# Altium schematic sheet kuzgunfe_fc0.2.SchDoc
size A3
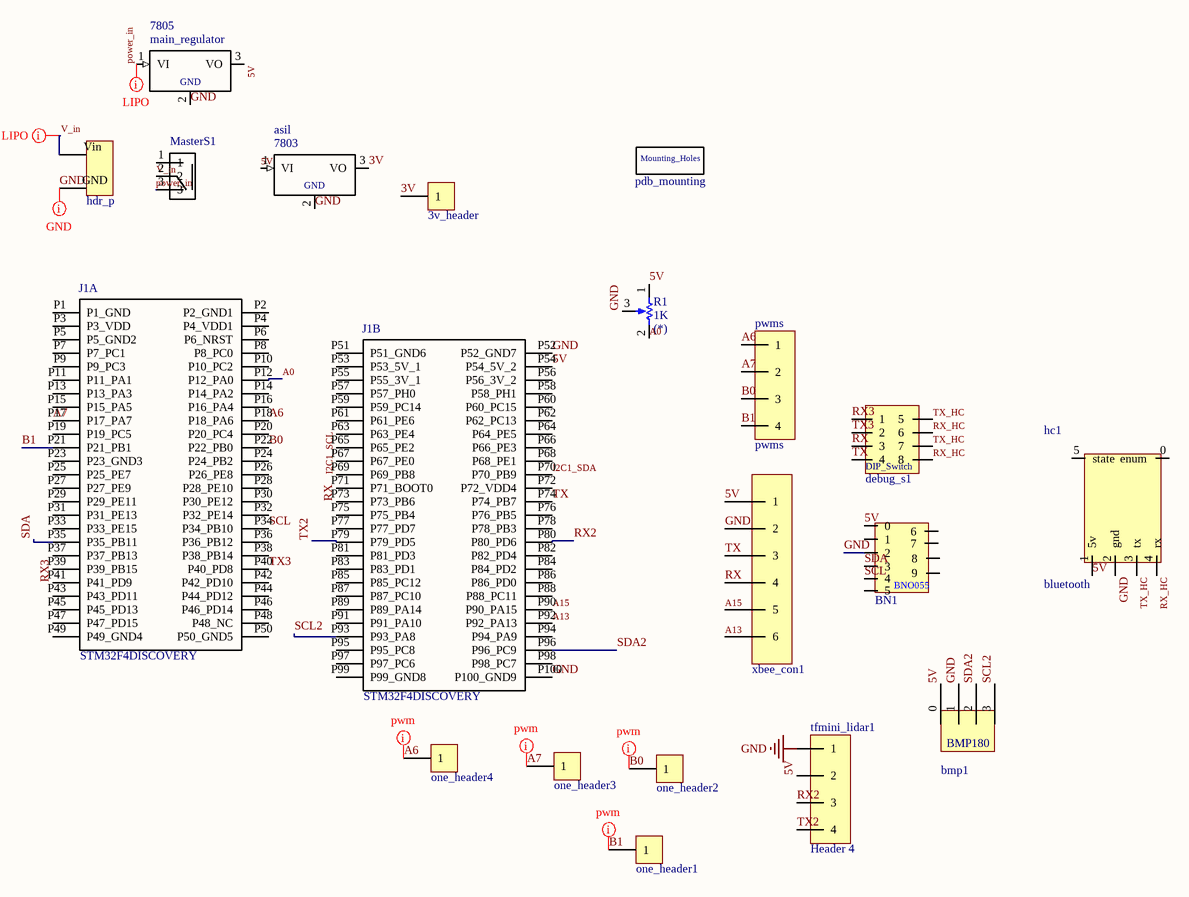
[diagram p0: kuzgunfe_fc0.2.SchDoc]

## Parts
3v_header  3v_header  [tekli_header]  (value not drawn)
7805  main_regulator  [TO92-]
asil  7803  [TO92-]
bmp1  bmp  [bmp]  (value not drawn)
BN1  BNO055  [bno055]  (value not drawn)
debug_s1  dipswitch  [JUMPER4_PIN]  (value not drawn)
hc1  bluetooth  [hc05]
hdr_p  header_2_power  [HDR2_POWER]  (value not drawn)
J1  STM32F4DISCOVERY  [STMICROELECTRONICS_STM32F4DISCOVERY_STM32F4DISCOVERY(Primary)]  (parts A,B of 2)
MasterS1  Master_S  [SW]  (value not drawn)
one_header1  one_header  [tekli_header]  (value not drawn)
one_header2  one_header  [tekli_header]  (value not drawn)
one_header3  one_header  [tekli_header]  (value not drawn)
one_header4  one_header  [tekli_header]  (value not drawn)
pdb_mounting  pdb_mounting  [pdb_mounting_v1]  (value not drawn)
pwms  pwms  [HDR4_pin]
R1  value 1K  TYPE: (*)  [pot_alpha]  (hidden comment: ALPHA Potentiometer)
tfmini_lidar1  Header 4  [HDR4_pin]
xbee_con1  header_6  [hdr_6pın]  (value not drawn)

## Nets
GND: 7805.2(GND) asil.2(GND) bmp1.1 BN1.2 hc1.2(gnd) hdr_p.GND J1.P52(P52_GND7) J1.P100(P100_GND9) R1.3(TAP) tfmini_lidar1.1 xbee_con1.2
3V: 3v_header.1 asil.3(VO)
5V: 7805.3(VO) asil.1(VI) bmp1.0 BN1.0 hc1.1(5v) J1.P54(P54_5V_2) R1.1(TOP) tfmini_lidar1.2 xbee_con1.1
A0: J1.P12(P12_PA0) R1.2(BOT)
A6: J1.P18(P18_PA6) one_header4.1 pwms.1
A7: J1.P17(P17_PA7) one_header3.1 pwms.2
A13: J1.P92(P92_PA13) xbee_con1.6
A15: J1.P90(P90_PA15) xbee_con1.5
B0: J1.P22(P22_PB0) one_header2.1 pwms.3
B1: J1.P21(P21_PB1) one_header1.1 pwms.4
I2C1_SCL: J1.P69(P69_PB8)
I2C1_SDA: J1.P70(P70_PB9)
power_in: 7805.1(VI) MasterS1.3
RX: debug_s1.3 J1.P73(P73_PB6) xbee_con1.4
RX2: J1.P80(P80_PD6) tfmini_lidar1.3
RX3: debug_s1.1 J1.P41(P41_PD9)
RX_HC: debug_s1.6 debug_s1.8 hc1.4(rx)
SCL: BN1.4 J1.P34(P34_PB10)
SCL2: bmp1.3 J1.P93(P93_PA8)
SDA: BN1.3 J1.P35(P35_PB11)
SDA2: bmp1.2 J1.P96(P96_PC9)
TX: debug_s1.4 J1.P74(P74_PB7) xbee_con1.3
TX2: J1.P79(P79_PD5) tfmini_lidar1.4
TX3: debug_s1.2 J1.P40(P40_PD8)
TX_HC: debug_s1.5 debug_s1.7 hc1.3(tx)
V_in: hdr_p.Vin MasterS1.2

Not connected (* = marked no-connect by the designer): BN1 1 5 6 7 8 9; hc1 0(enum) 5(state); J1 P1(P1_GND) P2(P2_GND1) P3(P3_VDD) P4(P4_VDD1) P5(P5_GND2) P6(P6_NRST) P7(P7_PC1) P8(P8_PC0) P9(P9_PC3) P10(P10_PC2) P11(P11_PA1) P13(P13_PA3) P14(P14_PA2) P15(P15_PA5) P16(P16_PA4) P19(P19_PC5) P20(P20_PC4) P23(P23_GND3) P24(P24_PB2) P25(P25_PE7) P26(P26_PE8) P27(P27_PE9) P28(P28_PE10) P29(P29_PE11) P30(P30_PE12) P31(P31_PE13) P32(P32_PE14) P33(P33_PE15) P36(P36_PB12) P37(P37_PB13) P38(P38_PB14) P39(P39_PB15) P42(P42_PD10) P43(P43_PD11) P44(P44_PD12) P45(P45_PD13) P46(P46_PD14) P47(P47_PD15) P48(P48_NC) P49(P49_GND4) P50(P50_GND5) P51(P51_GND6) P53(P53_5V_1) P55(P55_3V_1) P56(P56_3V_2) P57(P57_PH0) P58(P58_PH1) P59(P59_PC14) P60(P60_PC15) P61(P61_PE6) P62(P62_PC13) P63(P63_PE4) P64(P64_PE5) P65(P65_PE2) P66(P66_PE3) P67(P67_PE0) P68(P68_PE1) P71(P71_BOOT0) P72(P72_VDD4) P75(P75_PB4) P76(P76_PB5) P77(P77_PD7) P78(P78_PB3) P81(P81_PD3) P82(P82_PD4) P83(P83_PD1) P84(P84_PD2) P85(P85_PC12) P86(P86_PD0) P87(P87_PC10) P88(P88_PC11) P89(P89_PA14) P91(P91_PA10) P94(P94_PA9) P95(P95_PC8) P97(P97_PC6) P98(P98_PC7) P99(P99_GND8); MasterS1 1

## Layout directives
net class Undefined; rule Routing Layers [TopLayer - Enabled BottomLayer - Disabled]: A6, A7, B0, B1
net class LIPO; rule Routing Layers [TopLayer - DisabledBottomLayer - Enabled ]; rule Width Constraint [Pref Width = 20mil    Min Width = 20mil    Max Width = 20mil]: power_in, V_in
net class GND; rule Routing Layers [TopLayer - DisabledBottomLayer - Disabled]; rule Width Constraint [Pref Width = 10mil    Min Width = 10mil    Max Width = 10mil]: GND

## Notes on the sheet
- (in symbol bmp) BMP180
- (in symbol dipswitch) DIP_Switch
- (in symbol pdb_mounting) Mounting_Holes

## Library data of the parts
3v_header = one_header
7805 asil = 7805: Conn Quick Fit Header HDR 5 POS 5.1mm Solder RA Thru-Hole; MF: Keystone; SnapEDA_Link: https://www.snapeda.com/parts/7805/Keystone%20Electronics/view-part/?ref=snap; Price: 2.12 USD; MP: 7805; Package: None; Availability: Bad; Value: *
hc1 = hc05: bluetooth device hc 05
J1 = STM32F4DISCOVERY: Development kit: ARM ST; pin strips, pin header; No.of; MF: STMicroelectronics; Price: None; Package: None; SnapEDA_Link: https://www.snapeda.com/parts/STM32F4DISCOVERY/STMicroelectronics/view-part/?ref=snap; MP: STM32F4DISCOVERY; Availability: Unavailable; Value: *
MasterS1 = Master_S: Switch Slide ON ON SPDT Top Slide 0.1A 12VDC 10000Cycles PC Pins Thru-Hole Bulk; MF: C&K Components; Package: DO-201 C&amp;K Components; Price: 0.29 USD; SnapEDA_Link: https://www.snapeda.com/parts/OS102011MS2QN1/C%26K%20Components/view-part/?ref=snap; Availability: Good; Value: *
pwms = Header 4
R1 = alpha-pot: Potentiometer; Sim Note: Enter the Resistance value and the set point into parameter fields.; Set Position: 0.5; Published: 8-Jun-2000; LatestRevisionDate: 17-Jul-2002; LatestRevisionNote: Re-released for DXP Platform.; PackageReference: VR5; Publisher: Altium Limited; PackageDescription: Variable Resistor, Thru-Hole; 3 Leads